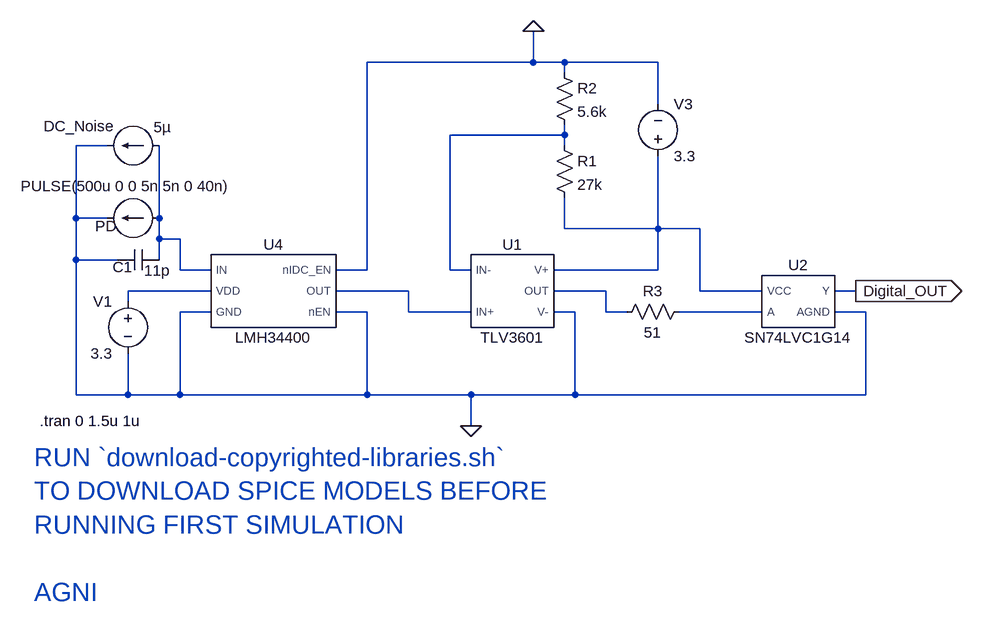
[diagram p0: schematic AAA_LMH34400_Sim.asc]
AAA_LMH34400_Sim.asc, the LTspice schematic file:
Version 4
SHEET 1 3480 680
WIRE 608 -192 608 -240
WIRE 608 -192 352 -192
WIRE 656 -192 608 -192
WIRE 800 -192 656 -192
WIRE 656 -176 656 -192
WIRE 800 -128 800 -192
WIRE 656 -80 656 -96
WIRE 656 -80 480 -80
WIRE -48 -64 -96 -64
WIRE 656 -64 656 -80
WIRE -96 48 -96 -64
WIRE -48 48 -96 48
WIRE 32 48 32 -64
WIRE 656 64 656 16
WIRE 800 64 800 -48
WIRE 800 64 656 64
WIRE 864 64 800 64
WIRE 32 80 32 48
WIRE 64 80 32 80
WIRE -96 112 -96 48
WIRE -32 112 -96 112
WIRE 32 112 32 80
WIRE 64 128 64 80
WIRE 112 128 64 128
WIRE 352 128 352 -192
WIRE 352 128 304 128
WIRE 480 128 480 -80
WIRE 512 128 480 128
WIRE 800 128 800 64
WIRE 800 128 640 128
WIRE 112 160 -16 160
WIRE 416 160 304 160
WIRE 720 160 640 160
WIRE 864 160 864 64
WIRE 960 160 864 160
WIRE 1104 160 1072 160
WIRE -16 176 -16 160
WIRE 112 192 64 192
WIRE 352 192 304 192
WIRE 416 192 416 160
WIRE 512 192 416 192
WIRE 672 192 640 192
WIRE 720 192 720 160
WIRE 752 192 720 192
WIRE 960 192 832 192
WIRE 1120 192 1072 192
WIRE -96 320 -96 112
WIRE -16 320 -16 256
WIRE -16 320 -96 320
WIRE 64 320 64 192
WIRE 64 320 -16 320
WIRE 352 320 352 192
WIRE 352 320 64 320
WIRE 512 320 352 320
WIRE 672 320 672 192
WIRE 672 320 512 320
WIRE 1120 320 1120 192
WIRE 1120 320 672 320
WIRE 512 368 512 320
FLAG 512 368 0
FLAG 1104 160 Digital_OUT
IOPIN 1104 160 Out
FLAG 608 -240 0
SYMBOL voltage -16 160 M0
WINDOW 123 0 0 Left 0
WINDOW 39 0 0 Left 0
SYMATTR InstName V1
SYMATTR Value 3.3
SYMBOL cap 32 96 R90
WINDOW 0 43 56 VBottom 2
WINDOW 3 17 3 VTop 2
SYMATTR InstName C1
SYMATTR Value 11p
SYMBOL current 32 48 R90
WINDOW 0 28 82 VBottom 2
WINDOW 3 -65 51 VTop 2
WINDOW 123 0 0 Left 0
WINDOW 39 0 0 Left 0
SYMATTR InstName PD
SYMATTR Value PULSE(500u 0 0 5n 5n 0 40n)
SYMBOL voltage 800 -32 M180
WINDOW 0 24 96 Left 2
WINDOW 3 24 16 Left 2
WINDOW 123 0 0 Left 0
WINDOW 39 0 0 Left 0
SYMATTR InstName V3
SYMATTR Value 3.3
SYMBOL res 640 -80 R0
SYMATTR InstName R1
SYMATTR Value 27k
SYMBOL res 640 -192 R0
SYMATTR InstName R2
SYMATTR Value 5.6k
SYMBOL res 848 176 R90
WINDOW 0 0 56 VBottom 2
WINDOW 3 32 56 VTop 2
SYMATTR InstName R3
SYMATTR Value 51
SYMBOL current 32 -64 R90
WINDOW 0 -14 123 VBottom 2
WINDOW 3 -44 -5 VTop 2
WINDOW 123 0 0 Left 0
WINDOW 39 0 0 Left 0
SYMATTR InstName DC_Noise
SYMATTR Value 5µ
SYMBOL LMH34400 208 160 R0
SYMATTR InstName U4
SYMBOL SN74LVC1G14 1008 176 R0
SYMATTR InstName U2
SYMBOL TLV3601 576 160 R0
SYMATTR InstName U1
TEXT -152 360 Left 2 !.tran 0 1.5u 1u
TEXT -160 416 Left 4 ;RUN `download-copyrighted-libraries.sh`\nTO DOWNLOAD SPICE MODELS BEFORE\nRUNNING FIRST SIMULATION\n \nAGNI

The netlist it stands for:
* AAA_LMH34400_Sim.asc
V1 N004 0 3.3
C1 N002 0 11p
I§PD N002 0 PULSE(500u 0 0 5n 5n 0 40n)
V3 N003 0 3.3
R1 N001 N003 27k
R2 0 N001 5.6k
R3 N007 N006 51
I§DC_Noise N002 0 5µ
XU4 N002 N004 0 0 0 N005 LMH34400  ; pins IN VDD nEN nIDC_EN GND OUT
XU2 Digital_OUT N007 N003 0 SN74LVC1G14  ; pins Y A VCC AGND
XU1 N005 N001 N003 0 N006 TLV3601  ; pins IN+ IN- V+ V- OUT
.tran 0 1.5u 1u
* RUN `download-copyrighted-libraries.sh`
* TO DOWNLOAD SPICE MODELS BEFORE
* RUNNING FIRST SIMULATION
* AGNI
.lib lmh34400.lib
.lib SN74LVC1G14.cir
.lib tlv3601.lib
.backanno
.end